# EasyEDA schematic schematic.json
TITLE: Sheet_1; REV: 1.0; Date: 2020-06-11; Sheet: 1/1; Drawn By: smhamza; Company: Your Company
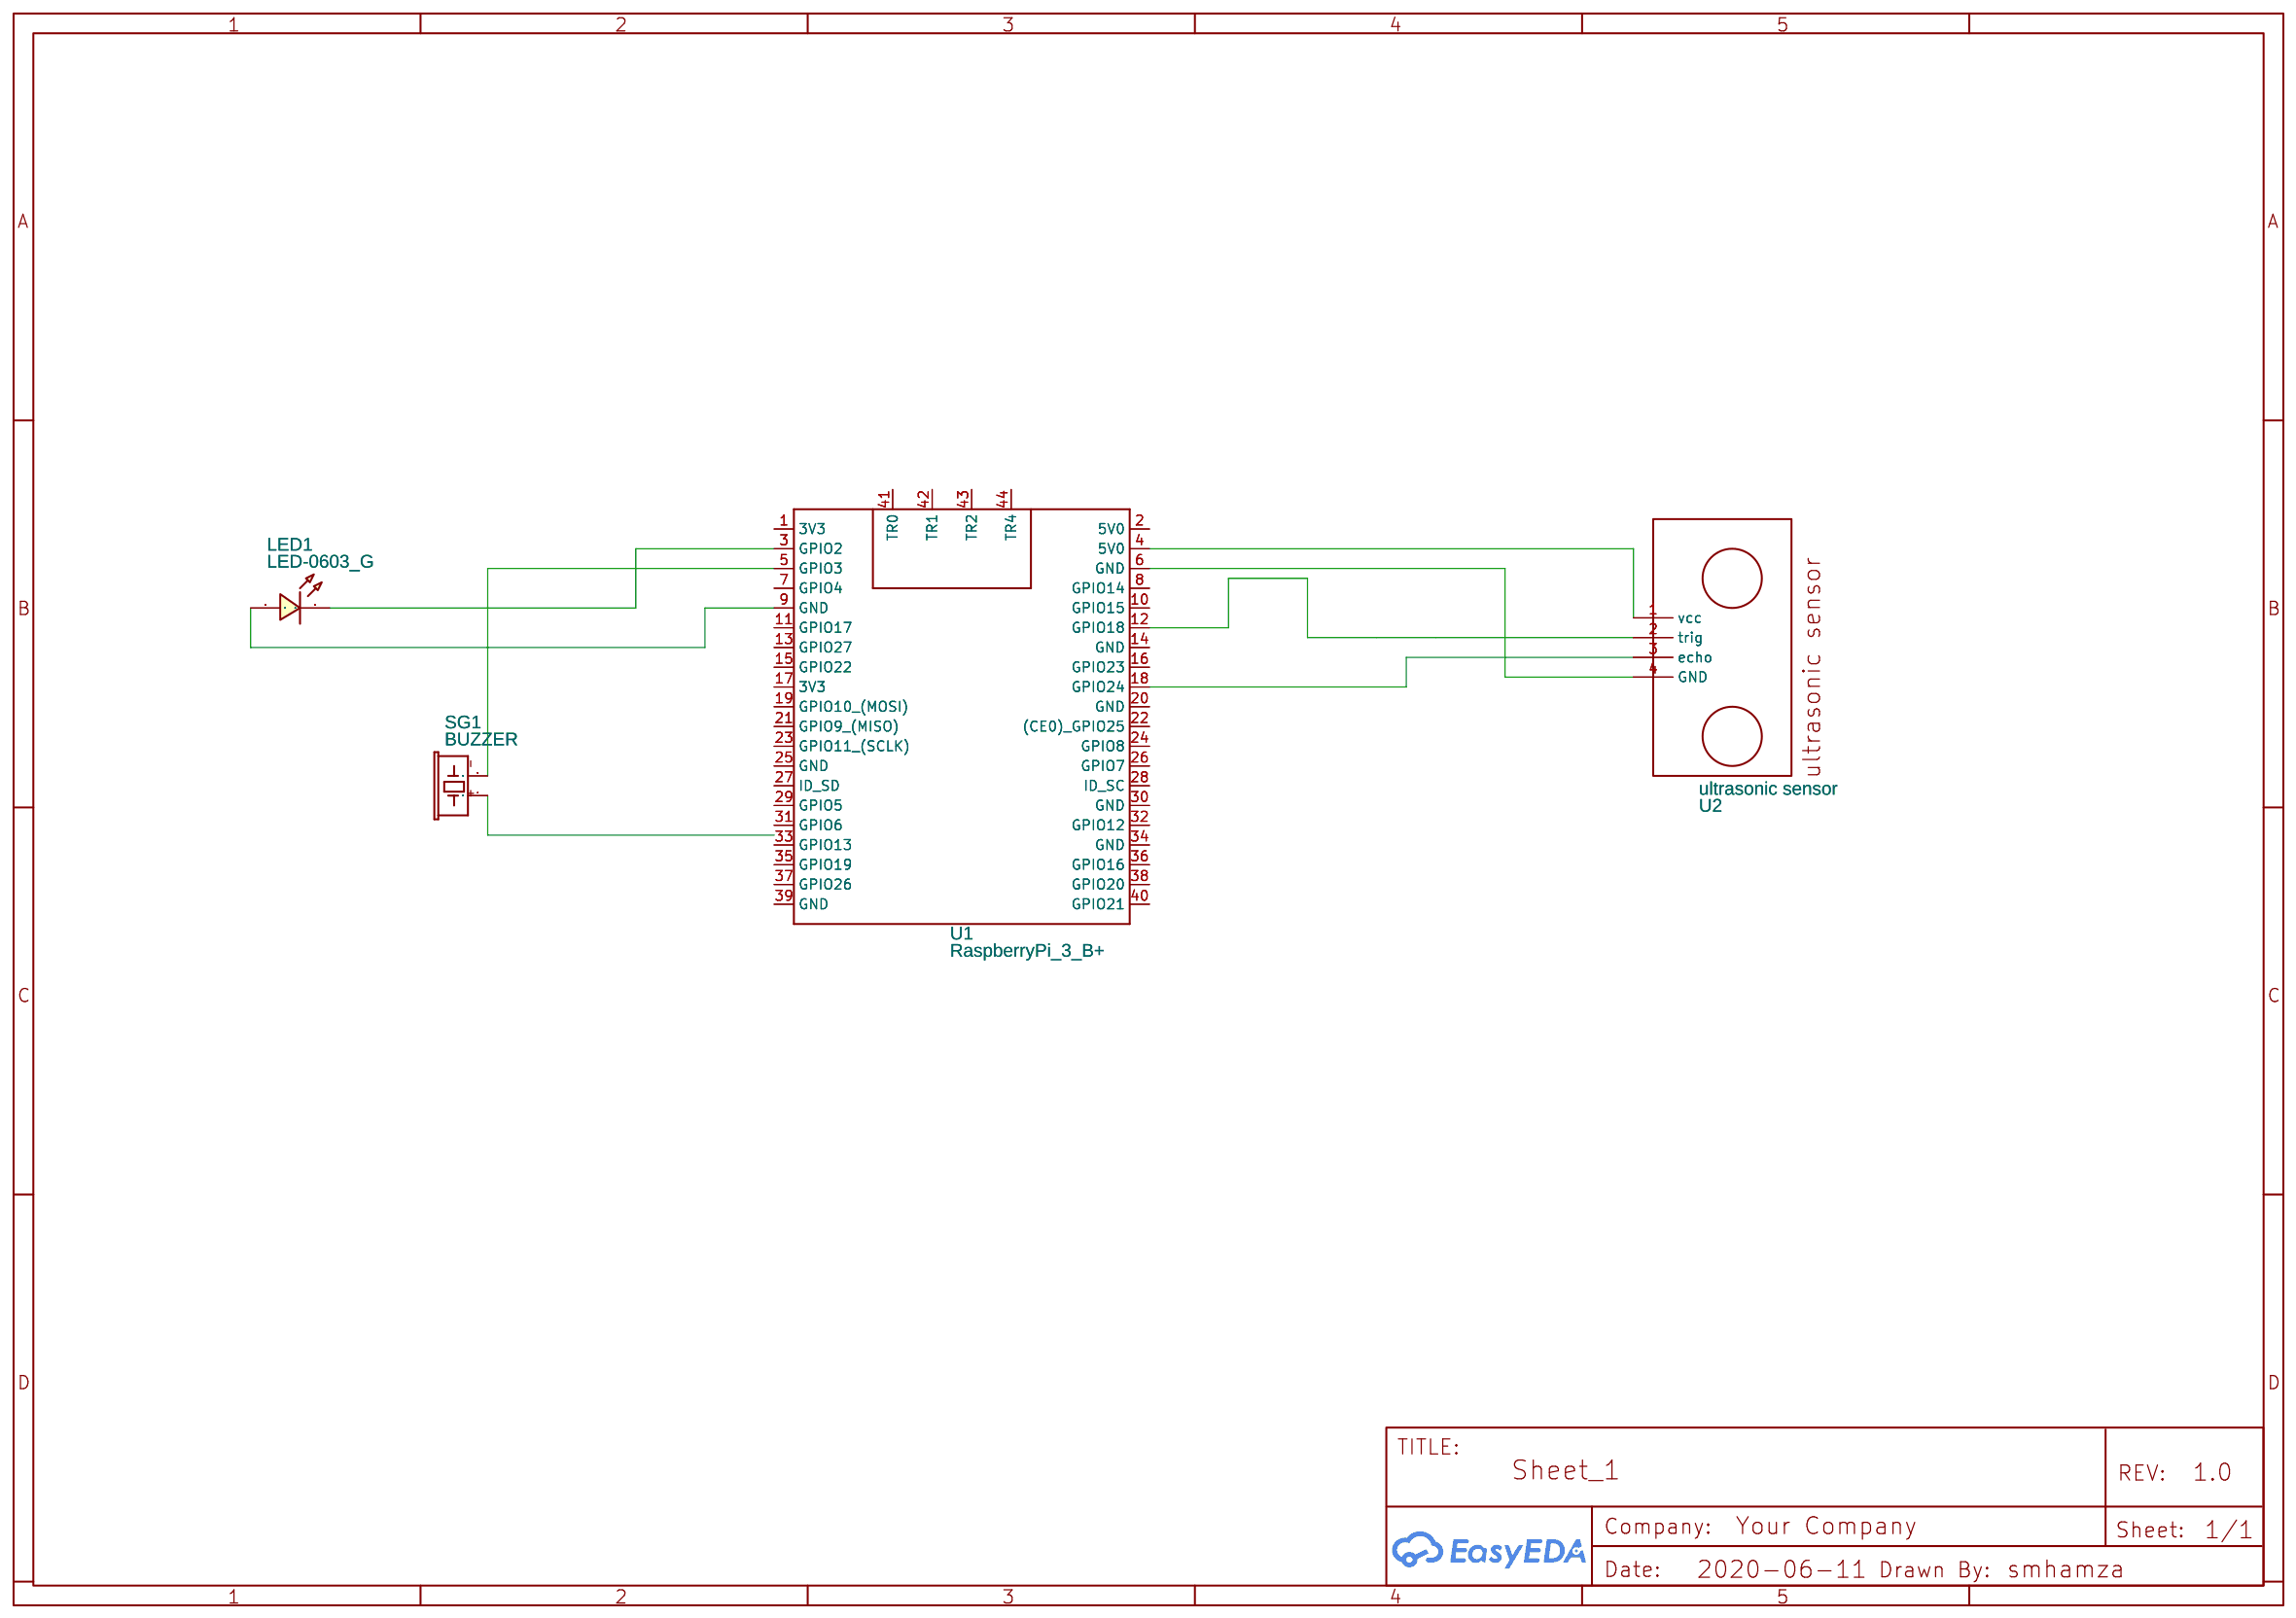
[diagram p0: schematic sheet]

## Parts
LED1  LED-0603_G  [LED0603_GREEN]
SG1  BUZZER  [BUZZER-HOFFMANN]
U1  RaspberryPi_3_B+  [RASBERRYPI_3_B+_POE]
U2  ultrasonic sensor  [ULTRASONIC SENSOR]

## Library data of the parts
LED1 = LED-0603_G: Manufacturer: EVERLIGHT(台湾亿光); Manufacturer Part: 19-217/GHC-YR1S2/3T; Supplier Part: C72043; Supplier: LCSC; Contributor: LCEDA_Lib
SG1 = BUZZER: Contributor: SparkFun
U1 = RaspberryPi_3_B+: Manufacturer Part: RaspberryPi 3; Contributor: sebasiano
U2 = ultrasonic sensor: Supplier: LCSC; Contributor: Aksen; Package Display: No

## Nets
Net-(LED1-1): LED1.1 U1.9(GND)
Net-(LED1-2): LED1.2 U1.3(GPIO2)
Net-(SG1-2): SG1.2 U1.5(GPIO3)
Net-(U1-4): U1.4(5V0) U2.1(vcc)
Net-(U1-6): U1.6(GND) U2.4(GND)
Net-(U1-12): U1.12(GPIO18) U2.2(trig)
Net-(U1-18): U1.18(GPIO24) U2.3(echo)

Not connected (* = marked no-connect by the designer): SG1 1; U1 1(3V3) 2(5V0) 7(GPIO4) 8(GPIO14) 10(GPIO15) 11(GPIO17) 13(GPIO27) 14(GND) 15(GPIO22) 16(GPIO23) 17(3V3) 19(GPIO10 (MOSI)) 20(GND) 21(GPIO9 (MISO)) 22((CE0) GPIO25) 23(GPIO11 (SCLK)) 24(GPIO8) 25(GND) 26(GPIO7) 27(ID_SD) 28(ID_SC) 29(GPIO5) 30(GND) 31(GPIO6) 32(GPIO12) 33(GPIO13) 34(GND) 35(GPIO19) 36(GPIO16) 37(GPIO26) 38(GPIO20) 39(GND) 40(GPIO21) 41(TR0) 42(TR1) 43(TR2) 44(TR4)
